# Altium schematic sheet pca10040_sheet2_interface_mcu.SchDoc: PCA10040 - Interface MCU
size A3; Revision: 0.9.0; SheetNumber: 2; SheetTotal: 5; DrawnBy: KJP; ProjectNumber: 4397; PCAName: PCA10040; PCBRevision: 0069KJP; DocumentSize: A3; PCBNumber: 400150; ProjectName: Quark
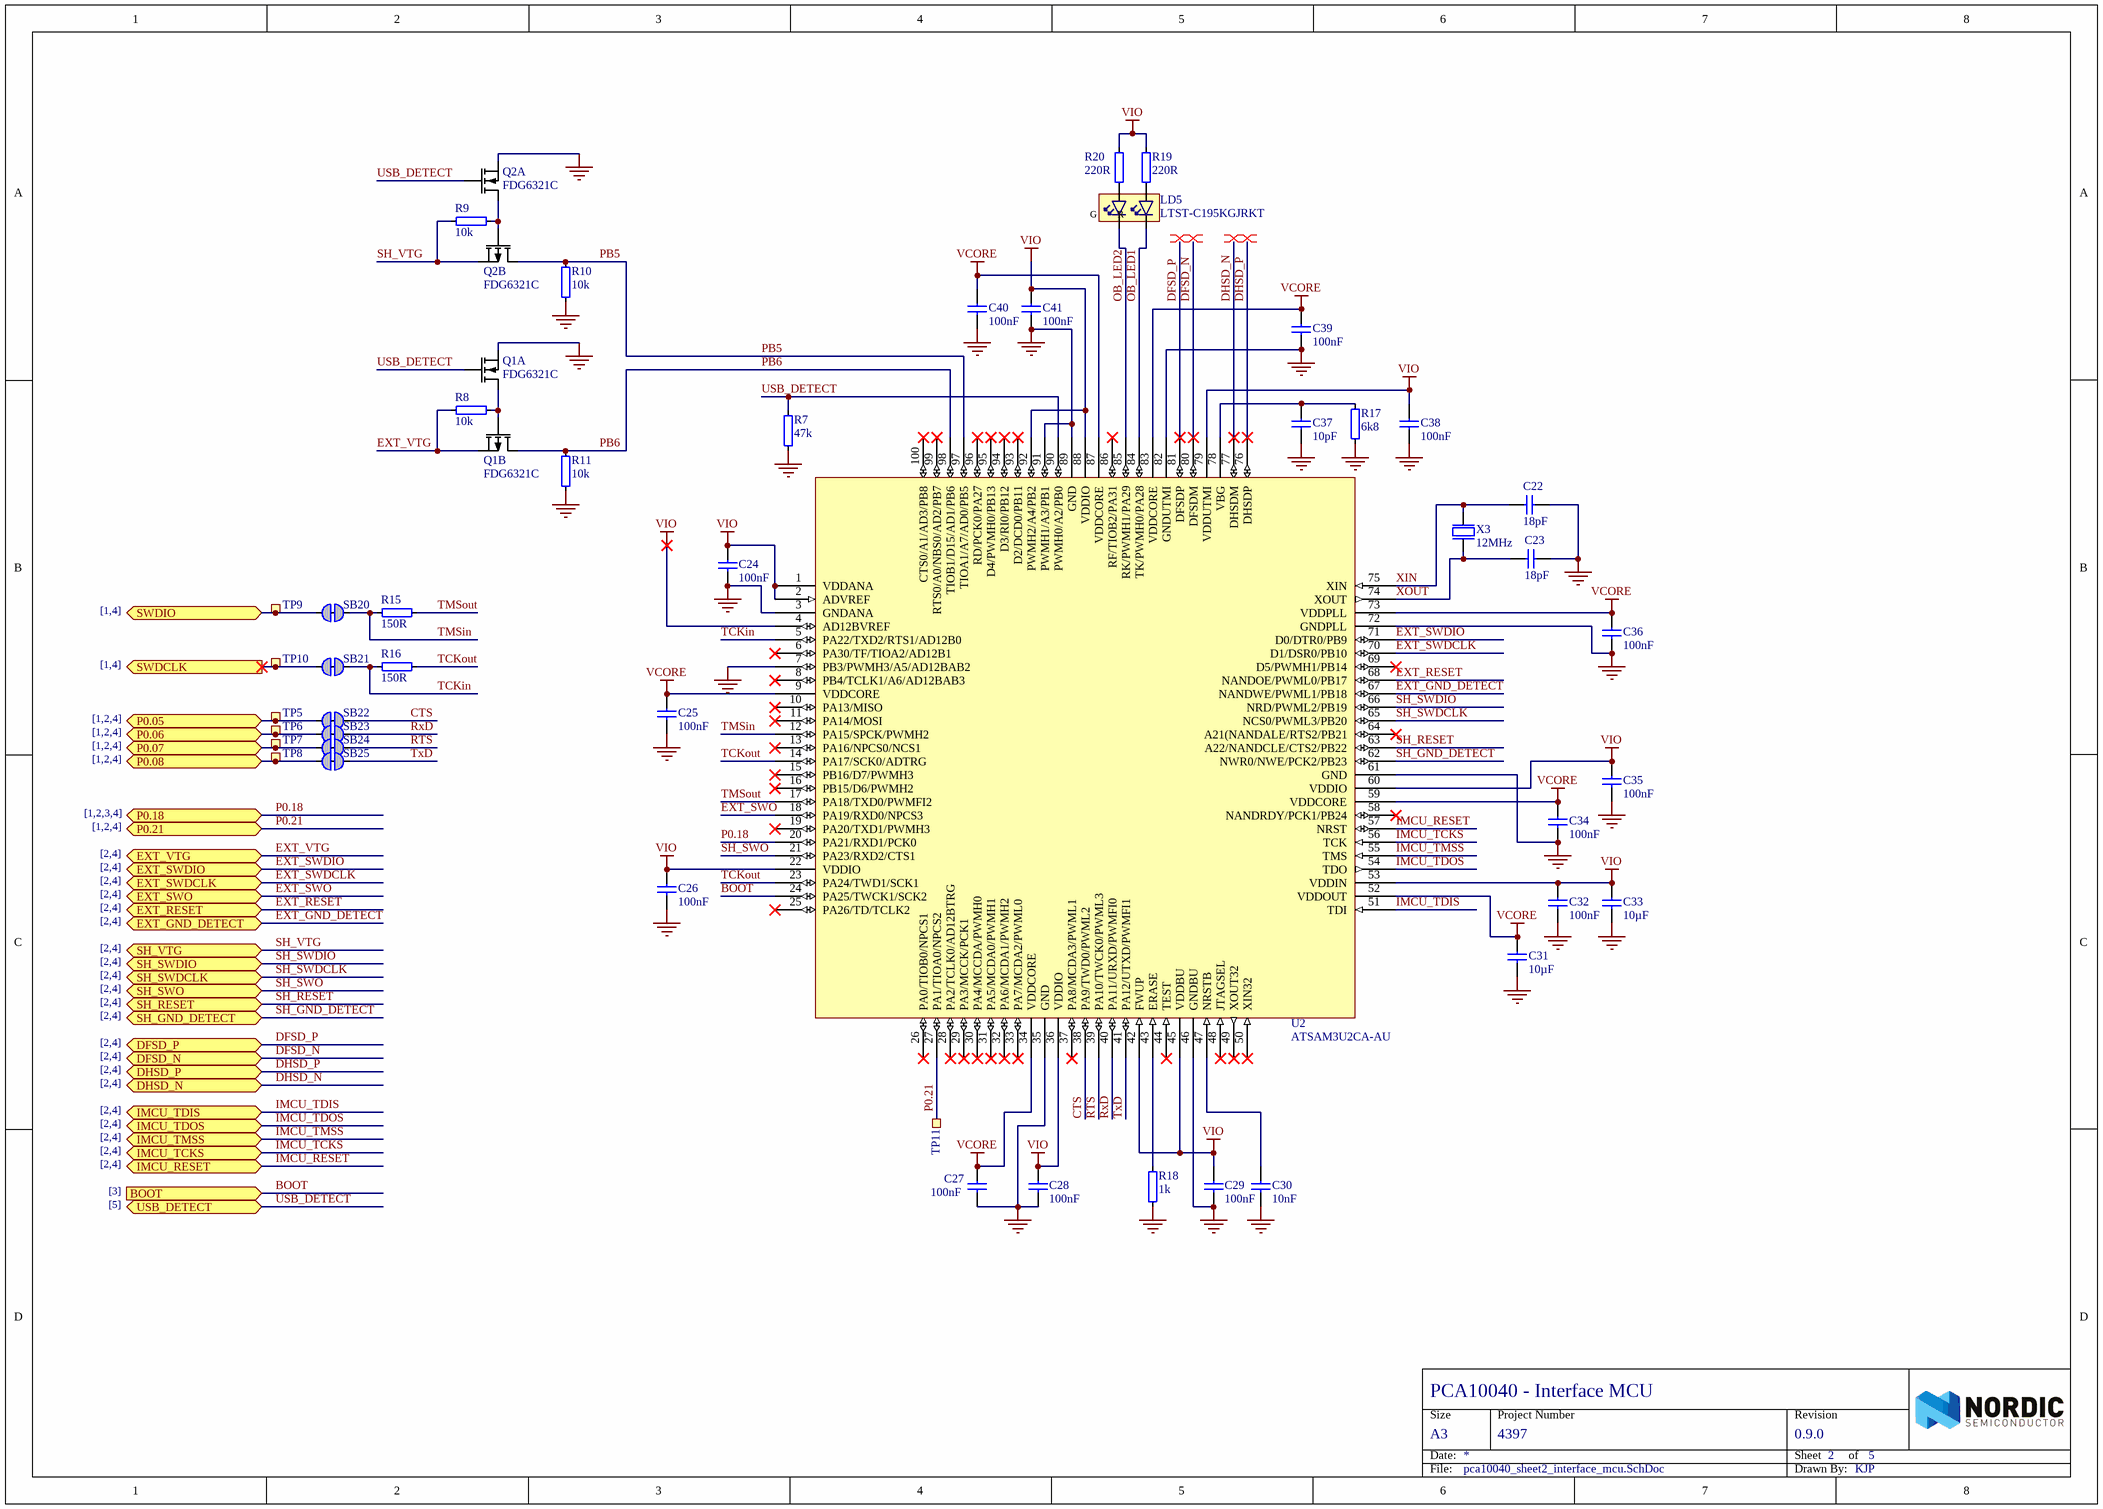
[diagram p0: pca10040_sheet2_interface_mcu.SchDoc]

## Parts
C22  18pF  [CAPC1005X04L]
C23  18pF  [CAPC1005X04L]
C24  100nF  [CAPC1005X04L]
C25  100nF  [CAPC1005X04L]
C26  100nF  [CAPC1005X04L]
C27  100nF  [CAPC1005X04L]
C28  100nF  [CAPC1005X04L]
C29  100nF  [CAPC1005X04L]
C30  10nF  [CAPC1005X04L]
C31  10µF  [CAPC1608X06L]
C32  100nF  [CAPC1005X04L]
C33  10µF  [CAPC1608X06L]
C34  100nF  [CAPC1005X04L]
C35  100nF  [CAPC1005X04L]
C36  100nF  [CAPC1005X04L]
C37  10pF  [CAPC1005X04L]
C38  100nF  [CAPC1005X04L]
C39  100nF  [CAPC1005X04L]
C40  100nF  [CAPC1005X04L]
C41  100nF  [CAPC1005X04L]
LD5  LTST-C195KGJRKT  [LED_DUAL_0606]
Q1  FDG6321C  [SOT65P210X100-6N]  (parts A,B of 2)
Q2  FDG6321C  [SOT65P210X100-6N]  (parts A,B of 2)
R7  47k  [RESC1005X04L]
R8  10k  [RESC1005X04L]
R9  10k  [RESC1005X04L]
R10  10k  [RESC1005X04L]
R11  10k  [RESC1005X04L]
R15  150R  [RESC1005X04L]
R16  150R  [RESC1005X04L]
R17  6k8  [RESC1005X04L]
R18  1k  [RESC1005X04L]
R19  220R  [RESC1005X04L]
R20  220R  [RESC1005X04L]
SB20  Solderbridge  [Solderbridge_Shorted]  (value not drawn)  (net tie, no BOM)
SB21  Solderbridge  [Solderbridge_Shorted]  (value not drawn)  (net tie, no BOM)
SB22  Solderbridge  [Solderbridge_Shorted]  (value not drawn)  (net tie, no BOM)
SB23  Solderbridge  [Solderbridge_Shorted]  (value not drawn)  (net tie, no BOM)
SB24  Solderbridge  [Solderbridge_Shorted]  (value not drawn)  (net tie, no BOM)
SB25  Solderbridge  [Solderbridge_Shorted]  (value not drawn)  (net tie, no BOM)
TP5  Ø1.0mm,SMD  [TP_SMD_Ø1.0mm]  (value not drawn)  (no BOM)
TP6  Ø1.0mm,SMD  [TP_SMD_Ø1.0mm]  (value not drawn)  (no BOM)
TP7  Ø1.0mm,SMD  [TP_SMD_Ø1.0mm]  (value not drawn)  (no BOM)
TP8  Ø1.0mm,SMD  [TP_SMD_Ø1.0mm]  (value not drawn)  (no BOM)
TP9  Ø1.0mm,SMD  [TP_SMD_Ø1.0mm]  (value not drawn)  (no BOM)
TP10  Ø1.0mm,SMD  [TP_SMD_Ø1.0mm]  (value not drawn)  (no BOM)
TP11  Ø1.0mm,SMD  [TP_SMD_Ø1.0mm]  (value not drawn)  (no BOM)
U2  ATSAM3U2CA-AU  [TSQFP50P1600X1600X160-100N]
X3  12MHz  [BT-XTAL_3225]

## Ports
BOOT (in), DFSD_N (bidir), DFSD_P (bidir), DHSD_N (bidir), DHSD_P (bidir), EXT_GND_DETECT (bidir), EXT_RESET (bidir), EXT_SWDCLK (bidir), EXT_SWDIO (bidir), EXT_SWO (bidir), EXT_VTG (bidir), IMCU_RESET (bidir), IMCU_TCKS (bidir), IMCU_TDIS (bidir), IMCU_TDOS (bidir), IMCU_TMSS (bidir), P0.05 (bidir), P0.06 (bidir), P0.07 (bidir), P0.08 (bidir), P0.18 (bidir), P0.21 (bidir), SH_GND_DETECT (bidir), SH_RESET (bidir), SH_SWDCLK (bidir), SH_SWDIO (bidir), SH_SWO (bidir), SH_VTG (bidir), SWDCLK (out), SWDIO (bidir), USB_DETECT (bidir)

## Nets
GND: C22.2 C23.2 C24.1 C25.1 C26.1 C27.1 C28.1 C29.1 C30.1 C31.1 C32.1 C33.1 C34.1 C35.1 C36.2 C37.1 C38.1 C39.1 C40.1 C41.1 Q1.1(S1) Q2.1(S1) R7.2 R10.1 R11.1 R17.1 R18.1 U2.3(GNDANA) U2.7(PB3/PWMH3/A5/AD12BAB2) U2.35(GND) U2.46(GNDBU) U2.61(GND) U2.72(GNDPLL) U2.82(GNDUTMI) U2.89(GND) U2.91(PWMH1/A3/PB1) X3.2(GND) X3.4(GND)
VCORE: C25.2 C27.2 C31.2 C34.2 C36.1 C39.2 C40.2 U2.9(VDDCORE) U2.34(VDDCORE) U2.52(VDDOUT) U2.59(VDDCORE) U2.73(VDDPLL) U2.83(VDDCORE) U2.87(VDDCORE)
VIO: C24.2 C26.2 C28.2 C29.2 C32.2 C33.2 C35.2 C38.2 C41.2 R19.2 R20.2 U2.1(VDDANA) U2.2(ADVREF) U2.4(AD12BVREF) U2.22(VDDIO) U2.36(VDDIO) U2.42(FWUP) U2.45(VDDBU) U2.53(VDDIN) U2.60(VDDIO) U2.79(VDDUTMI) U2.88(VDDIO) U2.92(PWMH2/A4/PB2)
BOOT: U2.24(PA25/TWCK1/SCK2) ; port BOOT
CTS: SB22.2 U2.38(PA9/TWD0/PWML2)
DFSD_N: U2.80(DFSDM) ; port DFSD_N
DFSD_P: U2.81(DFSDP) ; port DFSD_P
DHSD_N: U2.77(DHSDM) ; port DHSD_N
DHSD_P: U2.76(DHSDP) ; port DHSD_P
EXT_GND_DETECT: U2.67(NANDWE/PWML1/PB18) ; port EXT_GND_DETECT
EXT_RESET: U2.68(NANDOE/PWML0/PB17) ; port EXT_RESET
EXT_SWDCLK: U2.70(D1/DSR0/PB10) ; port EXT_SWDCLK
EXT_SWDIO: U2.71(D0/DTR0/PB9) ; port EXT_SWDIO
EXT_SWO: U2.18(PA19/RXD0/NPCS3) ; port EXT_SWO
EXT_VTG: Q1.4(S2) R8.1 ; port EXT_VTG
IMCU_RESET: U2.57(NRST) ; port IMCU_RESET
IMCU_TCKS: U2.56(TCK) ; port IMCU_TCKS
IMCU_TDIS: U2.51(TDI) ; port IMCU_TDIS
IMCU_TDOS: U2.54(TDO) ; port IMCU_TDOS
IMCU_TMSS: U2.55(TMS) ; port IMCU_TMSS
OB_LED1: LD5.4(C1) U2.84(TK/PWMH0/PA28)
OB_LED2: LD5.3(C2) U2.85(RK/PWMH1/PA29)
P0.05: SB22.1 TP5.1 ; port P0.05
P0.06: SB23.1 TP6.1 ; port P0.06
P0.07: SB24.1 TP7.1 ; port P0.07
P0.08: SB25.1 TP8.1 ; port P0.08
P0.18: U2.20(PA21/RXD1/PCK0) ; port P0.18
P0.21: TP11.1 U2.27(PA1/TIOA0/NPCS2) ; port P0.21
PB5: Q2.3(D2) R10.2 U2.97(TIOA1/A7/AD0/PB5)
PB6: Q1.3(D2) R11.2 U2.98(TIOB1/D15/AD1/PB6)
RTS: SB24.2 U2.39(PA10/TWCK0/PWML3)
RxD: SB23.2 U2.40(PA11/URXD/PWMFI0)
SH_GND_DETECT: U2.62(NWR0/NWE/PCK2/PB23) ; port SH_GND_DETECT
SH_RESET: U2.63(A22/NANDCLE/CTS2/PB22) ; port SH_RESET
SH_SWDCLK: U2.65(NCS0/PWML3/PB20) ; port SH_SWDCLK
SH_SWDIO: U2.66(NRD/PWML2/PB19) ; port SH_SWDIO
SH_SWO: U2.21(PA23/RXD2/CTS1) ; port SH_SWO
SH_VTG: Q2.4(S2) R9.1 ; port SH_VTG
SWDCLK: SB21.1 TP10.1 ; port SWDCLK
SWDIO: SB20.1 TP9.1 ; port SWDIO
TCKin: R16.2 SB21.2 U2.5(PA22/TXD2/RTS1/AD12B0)
TCKout: R16.1 U2.14(PA17/SCK0/ADTRG) U2.23(PA24/TWD1/SCK1)
TMSin: R15.2 SB20.2 U2.12(PA15/SPCK/PWMH2)
TMSout: R15.1 U2.17(PA18/TXD0/PWMFI2)
TxD: SB25.2 U2.41(PA12/UTXD/PWMFI1)
USB_DETECT: Q1.2(G1) Q2.2(G1) R7.1 U2.90(PWMH0/A2/PB0) ; port USB_DETECT
XIN: C22.1 U2.75(XIN) X3.3(out)
XOUT: C23.1 U2.74(XOUT) X3.1(inp)
NetC30_2: C30.2 U2.47(NRSTB)
NetC37_2: C37.2 R17.2 U2.78(VBG)
NetLD5_1: LD5.1(A2) R20.1
NetLD5_2: LD5.2(A1) R19.1
NetQ1_5: Q1.5(G2) Q1.6(D1) R8.2
NetQ2_5: Q2.5(G2) Q2.6(D1) R9.2
NetR18_2: R18.2 U2.43(ERASE)

Not connected (* = marked no-connect by the designer): U2 6(PA30/TF/TIOA2/AD12B1)* 8(PB4/TCLK1/A6/AD12BAB3)* 10(PA13/MISO)* 11(PA14/MOSI)* 13(PA16/NPCS0/NCS1)* 15(PB16/D7/PWMH3)* 16(PB15/D6/PWMH2)* 19(PA20/TXD1/PWMH3)* 25(PA26/TD/TCLK2)* 26(PA0/TIOB0/NPCS1)* 28(PA2/TCLK0/AD12BTRG)* 29(PA3/MCCK/PCK1)* 30(PA4/MCCDA/PWMH0)* 31(PA5/MCDA0/PWMH1)* 32(PA6/MCDA1/PWMH2)* 33(PA7/MCDA2/PWML0)* 37(PA8/MCDA3/PWML1)* 44(TEST)* 48(JTAGSEL)* 49(XOUT32)* 50(XIN32)* 58(NANDRDY/PCK1/PB24)* 64(A21(NANDALE/RTS2/PB21)* 69(D5/PWMH1/PB14)* 86(RF/TIOB2/PA31)* 93(D2/DCD0/PB11)* 94(D3/RI0/PB12)* 95(D4/PWMH0/PB13)* 96(RD/PCK0/PA27)* 99(RTS0/A0/NBS0/AD2/PB7)* 100(CTS0/A1/AD3/PB8)*

## Layout directives
differential pair: DFSD_N, DFSD_P, DHSD_N, DHSD_P

## Notes on the sheet
- [1,4]
- [1,2,4]
- [1,2,3,4]
- [2,4]
- [3]
- [5]
- Size
- Date:
- Project Number
- Sheet         of
- Revision
- File:
- Drawn By:
- (in symbol LTST-C195KGJRKT) G; R

## Library data of the parts
C22 C23 = C0402-18p: Capacitor, NP0, ±5%; Note: 50V; Artikkelnr Noca: 20029209; Artikkelnr Simpro: N.A.; Part Number: C0402-18p; Manufacturer: *; Manufacturer Part Number: *; Datasheet: *; LatestRevisionDate: 2009-05-08; Pin Count: 2; Publisher: Nordic Semiconductor; Published: 2009-05-08; Value: 18pF; Supplier: *; Supplier part number: *; 2nd source Supplier: *; 2nd source part number: *; Footprint Doc: 0402
C24-C29 C32 C34-C36 C38-C41 = C0402-100n: Capacitor, X7R, ±10%; Note: 16V; Artikkelnr Noca: 20039200; Artikkelnr Simpro: N.A.; Part Number: C0402-100n; Manufacturer: *; Manufacturer Part Number: *; Datasheet: *; LatestRevisionDate: 2009-11-23; Pin Count: 2; Publisher: Nordic Semiconductor; Published: 2009-05-08; Value: 100nF; Supplier: *; Supplier part number: *; 2nd source Supplier: *; 2nd source part number: *; Footprint Doc: 0402
C30 = C0402-10n: Capacitor, X7R, ±10%; Note: 16V; Artikkelnr Noca: 20039166; Artikkelnr Simpro: N.A.; Part Number: C0402-10n; Manufacturer: *; Manufacturer Part Number: *; Datasheet: *; LatestRevisionDate: 2009-11-23; Pin Count: 2; Publisher: Nordic Semiconductor; Published: 2009-05-08; Value: 10nF; Supplier: *; Supplier part number: *; 2nd source Supplier: *; 2nd source part number: *; Footprint Doc: 0402
C31 C33 = C0603-10µ: Capacitor, X5R, ±20%; Note: 6.3V; Artikkelnr Noca: 20039234; Artikkelnr Simpro: N.A.; Part Number: C0603-10µ; Manufacturer: *; Manufacturer Part Number: *; Datasheet: *; LatestRevisionDate: 2011-01-17; Pin Count: 2; Publisher: Nordic Semiconductor; Published: 2011-01-17; Value: 10µF; Supplier: *; Supplier part number: *; 2nd source Supplier: *; 2nd source part number: *; Footprint Doc: 0603
C37 = C0402-10p: Capacitor, NP0, ±2%; 2nd source part number: 185-6064; Note: 50V; Artikkelnr Noca: 20029260; Artikkelnr Simpro: N.A.; Part Number: C0402-10p; Manufacturer: *; Manufacturer Part Number: *; Datasheet: *; LatestRevisionDate: 2009-05-08; Pin Count: 2; Publisher: Nordic Semiconductor; Published: 2009-05-08; Value: 10pF; Supplier: Digi-Key; Supplier part number: 712-1252-1-ND; 2nd source Supplier: Farnell; Footprint Doc: 0402
LD5 = LTST-C195KGJRKT: Ultra bright AlInGaP Bi-Color LED; Manufacturer: Lite-On Inc; 2nd source part number: 859-LTST-C195KGJRKT; Artikkelnr Noca: 13019145; Artikkelnr Simpro: N.A.; Part Number: LTST-C195KGJRKT; Manufacturer Part Number: LTST-C195KGJRKT; Datasheet: http://media.digikey.com/pdf/Data%20Sheets/Lite-On%20PDFs/LTST-C195KGJRKT.pdf; LatestRevisionDate: 2013-02-11; Pin Count: 4; Publisher: Nordic Semiconductor; Published: 2012-07-05; Value: LTST-C195KGJRKT; Note: *; Supplier: Digi-Key; Supplier part number: 160-1452-1-ND; 2nd source Supplier: Mouser; Footprint Doc: LED_DUAL_0606
Q1 Q2 = FDG6321C_IPC: Fairchild, FDG6321C, Dual N & P Channel Digital FET; 2nd source part number: FDG6321CCT-ND; Artikkelnr Noca: 35029089; Artikkelnr Simpro: N.A.; Part Number: FDG6321C_IPC; Manufacturer: Fairchild; Manufacturer Part Number: FDG6321C; Datasheet: http://www.fairchildsemi.com/ds/FD/FDG6321C.pdf; LatestRevisionDate: 2011-07-04; Pin Count: 6; Publisher: Nordic Semiconductor; Published: 2012-07-04; Value: FDG6321C; Note: Dual N & P Channel Digital FET; Supplier: Farnell; Supplier part number: 170-0689; 2nd source Supplier: Digi-Key; Footprint Doc: SC70-6
R7 = R0402-47k: Resistor, ±1%, 0.063W; Note: Chip Res 1%; Artikkelnr Noca: 27049113; Artikkelnr Simpro: N.A.; Part Number: R0402-47k; Manufacturer: *; Manufacturer Part Number: *; Datasheet: *; LatestRevisionDate: 2009-11-23; Pin Count: 2; Publisher: Nordic Semiconductor; Published: 2009-05-08; Value: 47k; Supplier: Farnell; Supplier part number: 146-9719; 2nd source Supplier: *; 2nd source part number: *; Footprint Doc: 0402
R8-R11 = R0402-10k: Resistor, ±1%, 0.063W; Note: Chip Res 1%; Artikkelnr Noca: 27049097; Artikkelnr Simpro: N.A.; Part Number: R0402-10k; Manufacturer: *; Manufacturer Part Number: *; Datasheet: *; LatestRevisionDate: 2009-11-23; Pin Count: 2; Publisher: Nordic Semiconductor; Published: 2009-05-08; Value: 10k; Supplier: Farnell; Supplier part number: 173-8864; 2nd source Supplier: *; 2nd source part number: *; Footprint Doc: 0402
R15 R16 = R0402-150: Resistor, ±1%, 0.063W; Note: Chip Res 1%; Artikkelnr Noca: 27049053; Artikkelnr Simpro: N.A.; Part Number: R0402-150; Manufacturer: *; Manufacturer Part Number: *; Datasheet: *; LatestRevisionDate: 2009-11-23; Pin Count: 2; Publisher: Nordic Semiconductor; Published: 2009-05-08; Value: 150R; Supplier: Farnell; Supplier part number: 173-8839; 2nd source Supplier: *; 2nd source part number: *; Footprint Doc: 0402
R17 = R0402-6k8: Resistor, ±1%, 0.063W; Note: Chip Res 1%; Artikkelnr Noca: 27049093; Artikkelnr Simpro: N.A.; Part Number: R0402-6k8; Manufacturer: *; Manufacturer Part Number: *; Datasheet: *; LatestRevisionDate: 2009-11-23; Pin Count: 2; Publisher: Nordic Semiconductor; Published: 2009-05-08; Value: 6k8; Supplier: Farnell; Supplier part number: 173-8862; 2nd source Supplier: *; 2nd source part number: *; Footprint Doc: 0402
R18 = R0402-1k0: Resistor, ±1%, 0.063W; Note: Chip Res 1%; Artikkelnr Noca: 27049073; Artikkelnr Simpro: N.A.; Part Number: R0402-1k0; Manufacturer: *; Manufacturer Part Number: *; Datasheet: *; LatestRevisionDate: 2009-11-23; Pin Count: 2; Publisher: Nordic Semiconductor; Published: 2009-05-08; Value: 1k; Supplier: Farnell; Supplier part number: 173-8850; 2nd source Supplier: *; 2nd source part number: *; Footprint Doc: 0402
R19 R20 = R0402-220: Resistor, ±1%, 0.063W; Note: Chip Res 1%; Artikkelnr Noca: 27049057; Artikkelnr Simpro: N.A.; Part Number: R0402-220; Manufacturer: *; Manufacturer Part Number: *; Datasheet: *; LatestRevisionDate: 2009-11-23; Pin Count: 2; Publisher: Nordic Semiconductor; Published: 2009-05-08; Value: 220R; Supplier: Farnell; Supplier part number: 173-8841; 2nd source Supplier: *; 2nd source part number: *; Footprint Doc: 0402
SB20-SB25 = Solderbridge Shorted: Shorted Solderbridge; Artikkelnr Noca: N.A.; Part Number: Solderbridge Shorted; Manufacturer: *; Manufacturer Part Number: *; Datasheet: *; LatestRevisionDate: 2012-08-07; Pin Count: 2; Publisher: Nordic Semiconductor; Published: 2012-08-07; Value: Solderbridge; Note: *; Supplier: *; Supplier part number: *; 2nd source Supplier: *; 2nd source part number: *; Footprint Doc: Solderbridge_Shorted; Artikkelnr Simpro: N.A.
TP5-TP11 = TP_SMD_Ø1.0MM: 1.0mm circular SMD testpad; Manufacturer: Nordic Semiconductor; Artikkelnr Noca: N.A.; Part Number: TP_SMD_Ø1.0MM; Manufacturer Part Number: *; Datasheet: *; LatestRevisionDate: 2013-06-11; Pin Count: 1; Publisher: Nordic Semiconductor; Published: 2013-06-11; Value: Ø1.0mm,SMD; Note: *; Supplier: *; Supplier part number: *; 2nd source Supplier: *; 2nd source part number: *; Footprint Doc: TP_SMD_Ø1.0mm; Artikkelnr Simpro: N.A.
U2 = ATSAM3U2CA-AU: IC MCU 32bit 128kB flash 100LQFP; Manufacturer: Atmel; 2nd source part number: 184-1662; Artikkelnr Noca: 15019073; Artikkelnr Simpro: N.A.; Part Number: ATSAM3U2CA-AU; Manufacturer Part Number: ATSAM3U2CA-AU; Datasheet: http://www.atmel.com/Images/6430s.pdf; LatestRevisionDate: 2012-06-01; Pin Count: 100; Publisher: Nordic Semiconductor; Published: 2012-06-01; Value: ATSAM3U2CA-AU; Note: *; Supplier: Digi-Key; Supplier part number: ATSAM3U2CA-AU-ND; 2nd source Supplier: Farnell; Footprint Doc: LQFP-100
X3 = XTAL SMD 12MHz (3225): XTAL SMD 3225, 12MHz, 18pF, ±30ppm; Manufacturer: TXC Corporation; Manufacturer Part Number: 7M-12.000MAAJ-T; 2nd source part number: 184-2056; Note: XTAL SMD 12.000MHz; Artikkelnr Noca: 22019166; Artikkelnr Simpro: N.A.; Part Number: XTAL SMD 12MHz (3225); Datasheet: http://www.txccrystal.com/images/pdf/7m.pdf; LatestRevisionDate: 2010-08-31; Pin Count: 4; Publisher: Nordic Semiconductor; Published: 2010-08-31; Value: 12MHz; Supplier: Digi-Key; Supplier part number: 887-1121-1-ND; 2nd source Supplier: Farnell; Footprint Doc: BT-XTAL_3225